# EAGLE board Roland+mem1 (EAGLE 6.6.0)
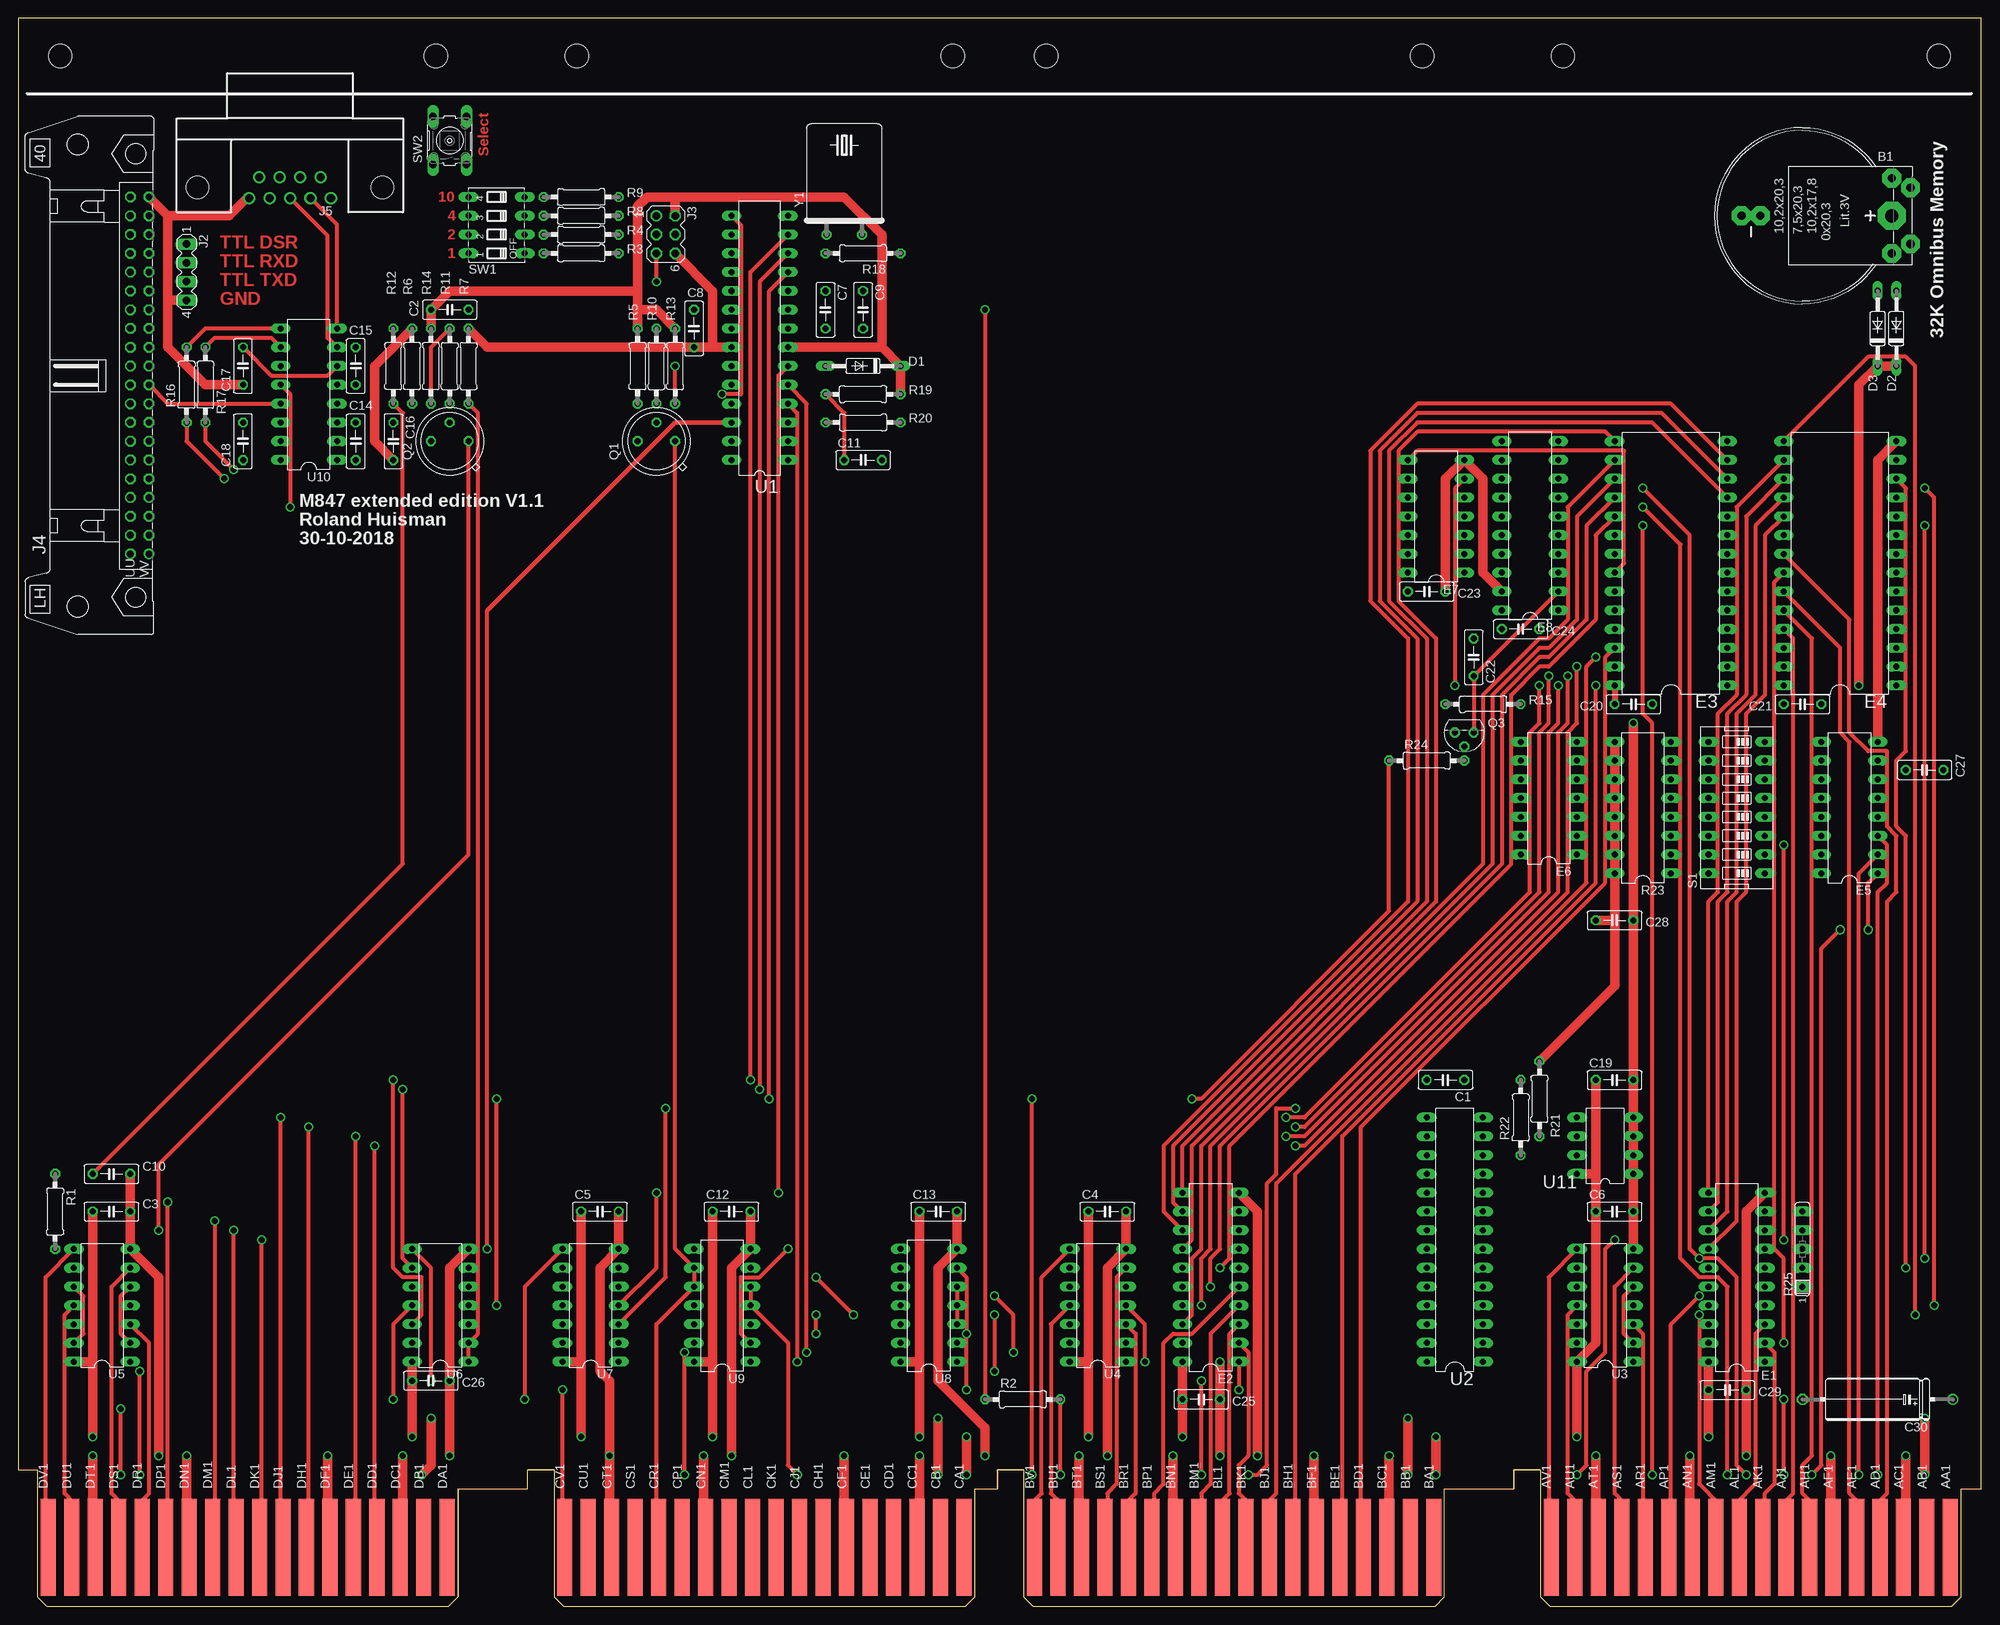
[diagram p3: board, top side]
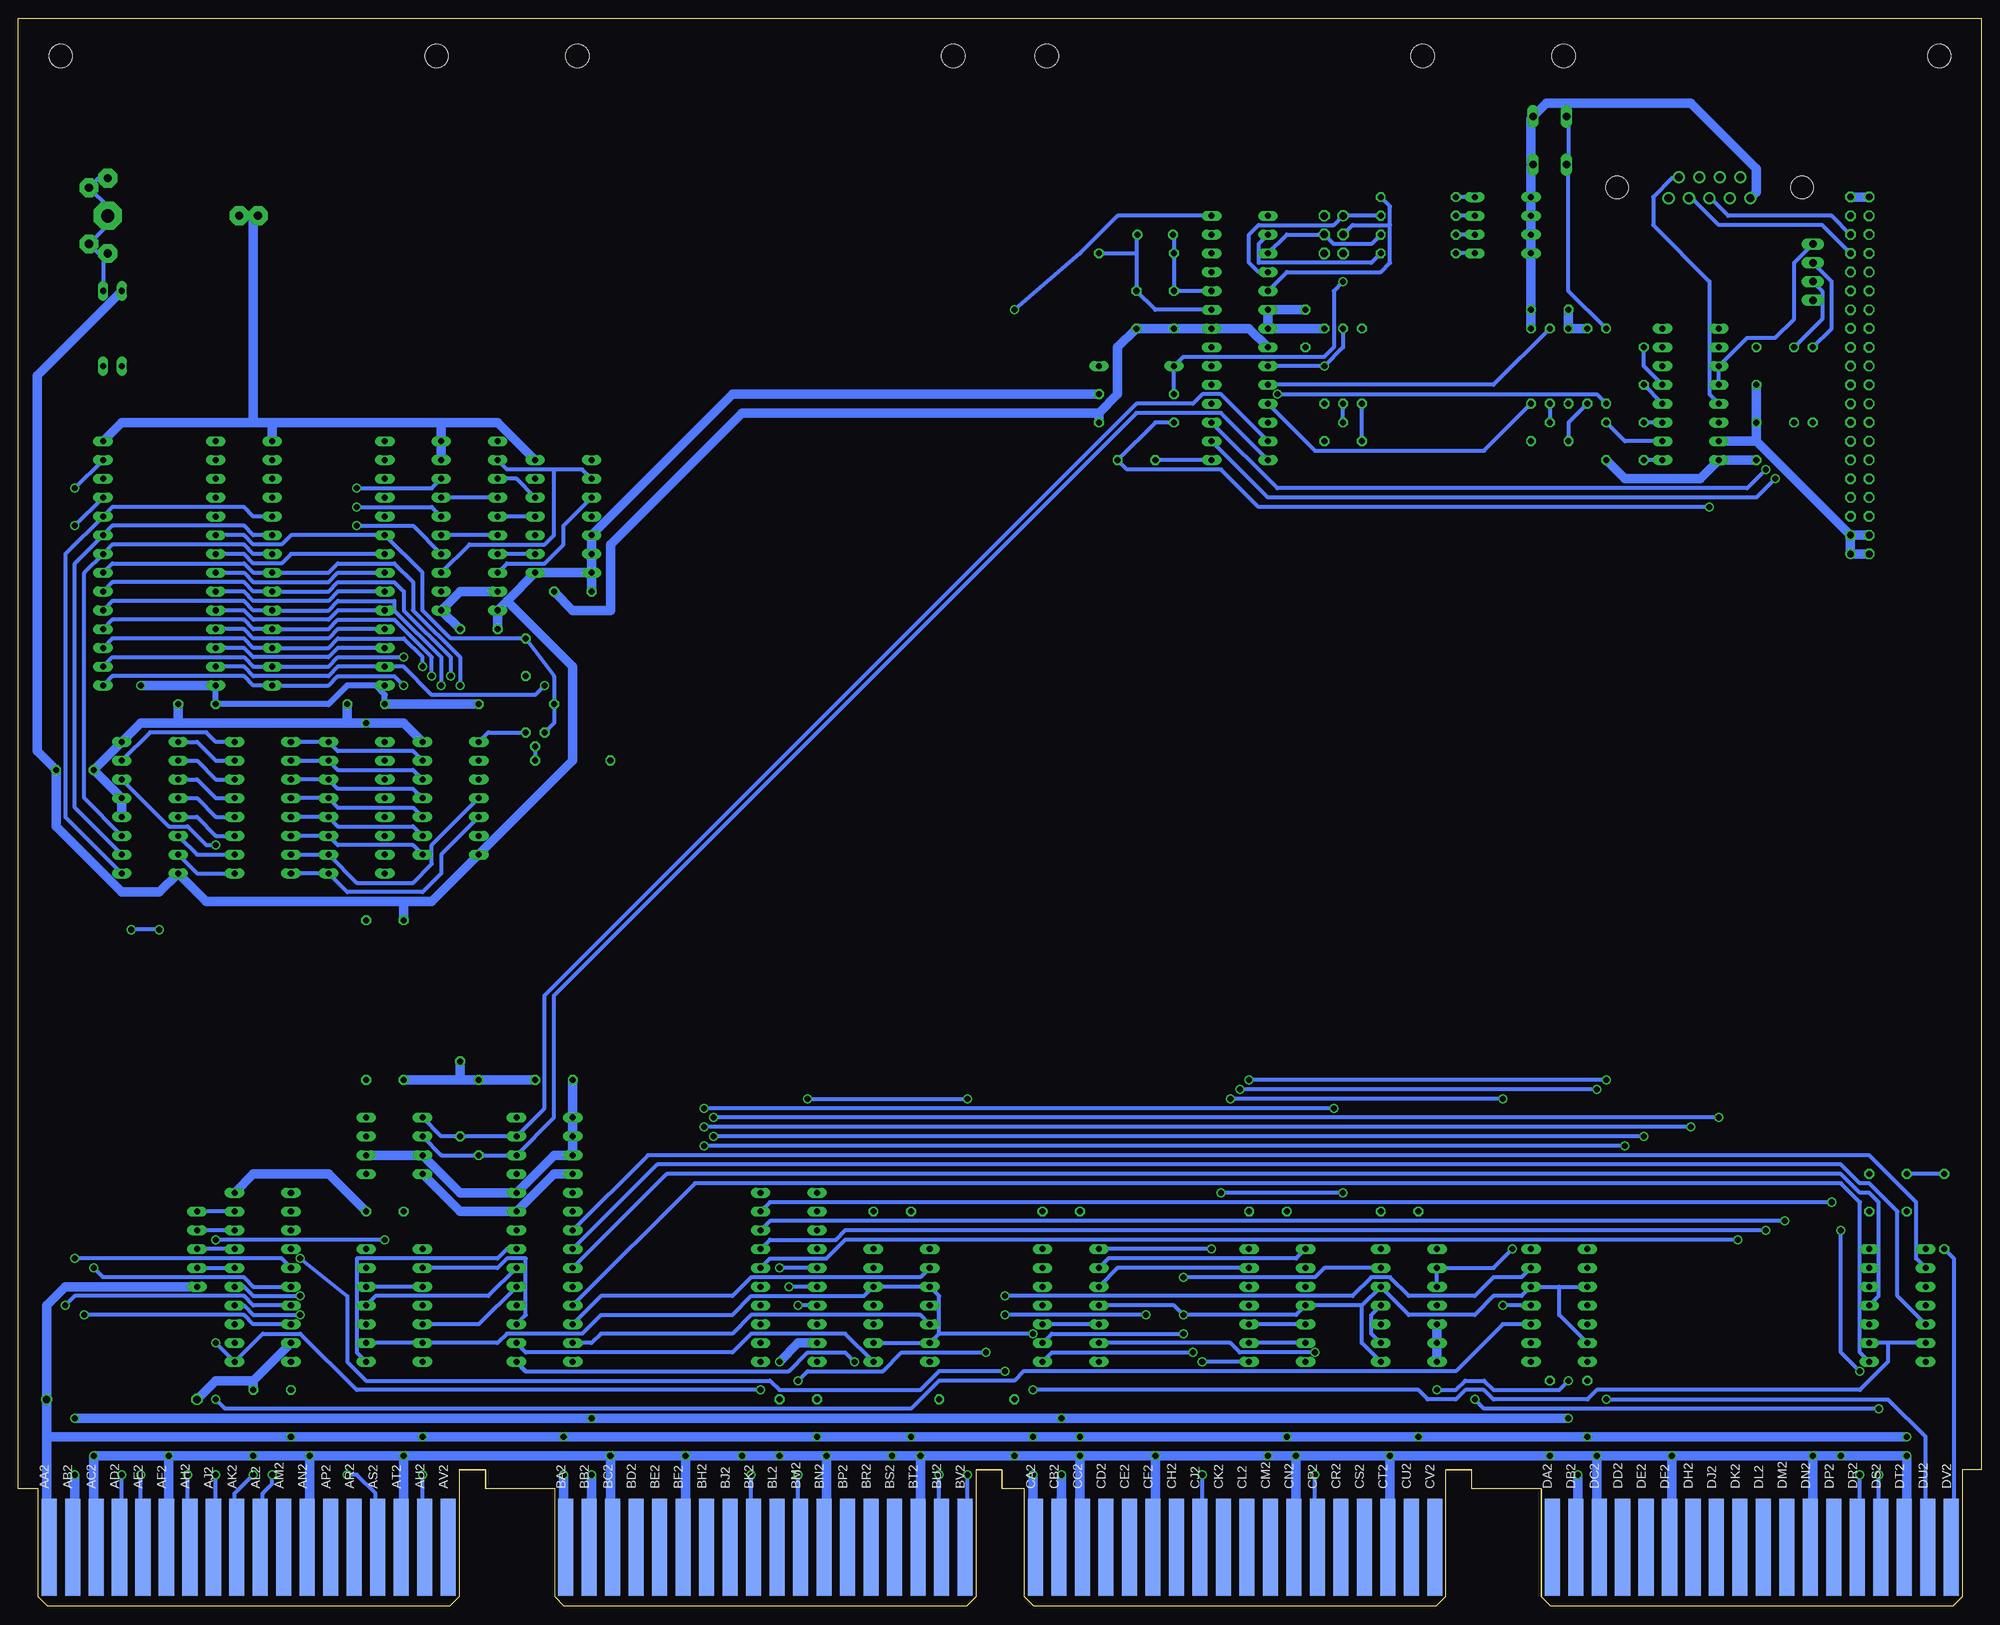
[diagram p4: board, bottom side, seen from below]

Size 265.3 x 214.63 mm. Coordinates in mm from the lower left corner, seen from the top.
Copper layers (1+16): Top 0.035mm / dielectric 1.5mm / Bottom 0.035mm
Design rules "16mils": minimum track width 16mil, minimum drill 32mil, track to track 15mil, track to pad 10mil, pad to pad 10mil, via to via 10mil, smd to smd 10mil, copper to edge 13mil, drill to drill 10mil, minimum pad ring 10mil, minimum via ring 8mil, stop-mask expansion 0mil, vias tented up to drill 0mil, thermal gap 10mil
Net classes: 0 default: width 0.508 mm; 1 supply: width 1.27 mm

## Footprints (pad centres in the part's own frame; a part is rotated, then mirrored left to right if it is on the bottom)
B2430UNI = drill 1.118 pad 2.54 octagon: + 3.81,14.605; +@1 -3.81,14.605; +@2 -5.08,12.065; +@3 5.08,12.065; - 0,-5.715; -@1 0,-8.255 | drill 1.803 pad 3.81 octagon: +@4 0,12.065
C050-025X075 = drill 0.813 octagon: 1 -2.54,0; 2 2.54,0
E12-8 = drill 1.016: + -10.16,0 | drill 1.016 octagon: - 10.16,0
DO35-10 = drill 0.813 long: A 5.08,0; C -5.08,0
DIL20 = drill 0.813 long: 1 -11.43,-3.81; 2 -8.89,-3.81; 3 -6.35,-3.81; 4 -3.81,-3.81; 5 -1.27,-3.81; 6 1.27,-3.81; 7 3.81,-3.81; 8 6.35,-3.81; 9 8.89,-3.81; 10 11.43,-3.81; 11 11.43,3.81; 12 8.89,3.81; 13 6.35,3.81; 14 3.81,3.81; 15 1.27,3.81; 16 -1.27,3.81; 17 -3.81,3.81; 18 -6.35,3.81; 19 -8.89,3.81; 20 -11.43,3.81
DIL28-6 = drill 0.813 long: 1 -16.51,-7.62; 2 -13.97,-7.62; 3 -11.43,-7.62; 4 -8.89,-7.62; 5 -6.35,-7.62; 6 -3.81,-7.62; 7 -1.27,-7.62; 8 1.27,-7.62; 9 3.81,-7.62; 10 6.35,-7.62; 11 8.89,-7.62; 12 11.43,-7.62; 13 13.97,-7.62; 14 16.51,-7.62; 15 16.51,7.62; 16 13.97,7.62; 17 11.43,7.62; 18 8.89,7.62; 19 6.35,7.62; 20 3.81,7.62; 21 1.27,7.62; 22 -1.27,7.62; 23 -3.81,7.62; 24 -6.35,7.62; 25 -8.89,7.62; 26 -11.43,7.62; 27 -13.97,7.62; 28 -16.51,7.62
DIL16 = drill 0.813 long: 1 -8.89,-3.81; 2 -6.35,-3.81; 3 -3.81,-3.81; 4 -1.27,-3.81; 5 1.27,-3.81; 6 3.81,-3.81; 7 6.35,-3.81; 8 8.89,-3.81; 9 8.89,3.81; 10 6.35,3.81; 11 3.81,3.81; 12 1.27,3.81; 13 -1.27,3.81; 14 -3.81,3.81; 15 -6.35,3.81; 16 -8.89,3.81
DIL14 = drill 0.813 long: 1 -7.62,-3.81; 2 -5.08,-3.81; 3 -2.54,-3.81; 4 0,-3.81; 5 2.54,-3.81; 6 5.08,-3.81; 7 7.62,-3.81; 8 7.62,3.81; 9 5.08,3.81; 10 2.54,3.81; 11 0,3.81; 12 -2.54,3.81; 13 -5.08,3.81; 14 -7.62,3.81
EDGE-CON8 = smd 2.032 x 13.106: AA1 261.303,7.938; AB1 258.127,7.938; AC1 254.952,7.938; AD1 251.778,7.938; AE1 248.602,7.938; AF1 245.428,7.938; AH1 242.252,7.938; AJ1 239.077,7.938; AK1 235.903,7.938; AL1 232.727,7.938; AM1 229.553,7.938; AN1 226.377,7.938; AP1 223.202,7.938; AR1 220.028,7.938; AS1 216.852,7.938; AT1 213.678,7.938; AU1 210.502,7.938; AV1 207.327,7.938; BA1 191.452,7.938; BB1 188.278,7.938; BC1 185.102,7.938; BD1 181.928,7.938; BE1 178.752,7.938; BF1 175.577,7.938; BH1 172.403,7.938; BJ1 169.227,7.938; BK1 166.053,7.938; BL1 162.877,7.938; BM1 159.702,7.938; BN1 156.528,7.938; BP1 153.352,7.938; BR1 150.178,7.938; BS1 147.002,7.938; BT1 143.827,7.938; BU1 140.653,7.938; BV1 137.477,7.938; CA1 127.953,7.938; CB1 124.778,7.938; CC1 121.603,7.938; CD1 118.427,7.938; CE1 115.252,7.938; CF1 112.078,7.938; CH1 108.903,7.938; CJ1 105.728,7.938; CK1 102.552,7.938; CL1 99.377,7.938; CM1 96.203,7.938; CN1 93.028,7.938; CP1 89.853,7.938; CR1 86.677,7.938; CS1 83.502,7.938; CT1 80.328,7.938; CU1 77.153,7.938; CV1 73.978,7.938; DA1 58.102,7.938; DB1 54.928,7.938; DC1 51.752,7.938; DD1 48.578,7.938; DE1 45.403,7.938; DF1 42.227,7.938; DH1 39.053,7.938; DJ1 35.877,7.938; DK1 32.703,7.938; DL1 29.527,7.938; DM1 26.352,7.938; DN1 23.177,7.938; DP1 20.003,7.938; DR1 16.828,7.938; DS1 13.652,7.938; DT1 10.477,7.938; DU1 7.303,7.938; DV1 4.128,7.938 | smd 2.032 x 13.106 bottom: AA2 261.303,7.938; AB2 258.127,7.938; AC2 254.952,7.938; AD2 251.778,7.938; AE2 248.602,7.938; AF2 245.428,7.938; AH2 242.252,7.938; AJ2 239.077,7.938; AK2 235.903,7.938; AL2 232.727,7.938; AM2 229.553,7.938; AN2 226.377,7.938; AP2 223.202,7.938; AR2 220.028,7.938; AS2 216.852,7.938; AT2 213.678,7.938; AU2 210.502,7.938; AV2 207.327,7.938; BA2 191.452,7.938; BB2 188.278,7.938; BC2 185.102,7.938; BD2 181.928,7.938; BE2 178.752,7.938; BF2 175.577,7.938; BH2 172.403,7.938; BJ2 169.227,7.938; BK2 166.053,7.938; BL2 162.877,7.938; BM2 159.702,7.938; BN2 156.528,7.938; BP2 153.352,7.938; BR2 150.178,7.938; BS2 147.002,7.938; BT2 143.827,7.938; BU2 140.653,7.938; BV2 137.477,7.938; CA2 127.953,7.938; CB2 124.778,7.938; CC2 121.603,7.938; CD2 118.427,7.938; CE2 115.252,7.938; CF2 112.078,7.938; CH2 108.903,7.938; CJ2 105.728,7.938; CK2 102.552,7.938; CL2 99.377,7.938; CM2 96.203,7.938; CN2 93.028,7.938; CP2 89.853,7.938; CR2 86.677,7.938; CS2 83.502,7.938; CT2 80.328,7.938; CU2 77.153,7.938; CV2 73.978,7.938; DA2 58.102,7.938; DB2 54.928,7.938; DC2 51.752,7.938; DD2 48.578,7.938; DE2 45.403,7.938; DF2 42.227,7.938; DH2 39.053,7.938; DJ2 35.877,7.938; DK2 32.703,7.938; DL2 29.527,7.938; DM2 26.352,7.938; DN2 23.177,7.938; DP2 20.003,7.938; DR2 16.828,7.938; DS2 13.652,7.938; DT2 10.477,7.938; DU2 7.303,7.938; DV2 4.128,7.938
MA04-1 = drill 1.016 long: 1 -3.81,0; 2 -1.27,0; 3 1.27,0; 4 3.81,0
MA03-2 = drill 1.016: 1 -2.54,-1.27 | drill 1.016 octagon: 2 -2.54,1.27; 3 0,-1.27; 4 0,1.27; 5 2.54,-1.27; 6 2.54,1.27
DEC40PINH = drill 0.914 octagon: A 24.13,1.27; AA -3.81,1.27; B 24.13,-1.27; BB -3.81,-1.27; C 21.59,1.27; CC -6.35,1.27; D 21.59,-1.27; DD -6.35,-1.27; E 19.05,1.27; EE -8.89,1.27; F 19.05,-1.27; FF -8.89,-1.27; H 16.51,1.27; HH -11.43,1.27; J 16.51,-1.27; JJ -11.43,-1.27; K 13.97,1.27; KK -13.97,1.27; L 13.97,-1.27; LL -13.97,-1.27; M 11.43,1.27; MM -16.51,1.27; N 11.43,-1.27; NN -16.51,-1.27; P 8.89,1.27; PP -19.05,1.27; R 8.89,-1.27; RR -19.05,-1.27; S 6.35,1.27; SS -21.59,1.27; T 6.35,-1.27; TT -21.59,-1.27; U 3.81,1.27; UU -24.13,1.27; V 3.81,-1.27; W 1.27,1.27; X 1.27,-1.27; Y -1.27,1.27; Z -1.27,-1.27 | drill 0.914: VV -24.13,-1.27
H5M09RA = drill 1.092: 1 -5.537,1.422; 2 -2.769,1.422; 3 0,1.422; 4 2.769,1.422; 5 5.537,1.422; 6 -4.153,-1.422; 7 -1.384,-1.422; 8 1.384,-1.422; 9 4.153,-1.422 | hole 3.048: -12.497,0; 12.497,0
TO5 = drill 0.813 octagon: 1 0,-2.54; 2 2.54,0; 3 0,2.54
TO92 = drill 0.813 octagon: 1 1.27,0; 2 0,1.905; 3 -1.27,0
0207/10 = drill 0.813 octagon: 1 -5.08,0; 2 5.08,0
SIL5 = drill 0.813 long: 1 -5.08,0; 2 -2.54,0; 3 0,0; 4 2.54,0; 5 5.08,0
EDG-08 = drill 0.813 long: 1 -8.89,-3.81; 2 -6.35,-3.81; 3 -3.81,-3.81; 4 -1.27,-3.81; 5 1.27,-3.81; 6 3.81,-3.81; 7 6.35,-3.81; 8 8.89,-3.81; 9 8.89,3.81; 10 6.35,3.81; 11 3.81,3.81; 12 1.27,3.81; 13 -1.27,3.81; 14 -3.81,3.81; 15 -6.35,3.81; 16 -8.89,3.81
DIP04S = drill 0.813 long: 1 -3.81,-3.81; 2 -1.27,-3.81; 3 1.27,-3.81; 4 3.81,-3.81; 5 3.81,3.81; 6 1.27,3.81; 7 -1.27,3.81; 8 -3.81,3.81
B3F-10XX = drill 1.016 long: 1 -3.251,2.261; 2 3.251,2.261; 3 -3.251,-2.261; 4 3.251,-2.261
DIL28-3 = drill 0.813 long: 1 -16.51,-3.81; 2 -13.97,-3.81; 3 -11.43,-3.81; 4 -8.89,-3.81; 5 -6.35,-3.81; 6 -3.81,-3.81; 7 -1.27,-3.81; 8 1.27,-3.81; 9 3.81,-3.81; 10 6.35,-3.81; 11 8.89,-3.81; 12 11.43,-3.81; 13 13.97,-3.81; 14 16.51,-3.81; 15 16.51,3.81; 16 13.97,3.81; 17 11.43,3.81; 18 8.89,3.81; 19 6.35,3.81; 20 3.81,3.81; 21 1.27,3.81; 22 -1.27,3.81; 23 -3.81,3.81; 24 -6.35,3.81; 25 -8.89,3.81; 26 -11.43,3.81; 27 -13.97,3.81; 28 -16.51,3.81
DIL8 = drill 0.813 long: 1 -3.81,-3.81; 2 -1.27,-3.81; 3 1.27,-3.81; 4 3.81,-3.81; 5 3.81,3.81; 6 1.27,3.81; 7 -1.27,3.81; 8 -3.81,3.81
OMNIBUS = hole 3.175: 208.915,209.55; 259.715,209.55; 189.865,209.55; 139.065,209.55; 75.616,209.55; 126.416,209.55; 56.566,209.55; 5.766,209.55
HC49U-H = drill 0.813: 1 -2.413,-5.08; 2 2.413,-5.08

## Placement (x,y rotation side)
B1  CR2032  [B2430UNI]  241.17,187.96 270 top
C1  100nF  [C050-025X075]  192.91,71.12 180 top
C2  100nF  [C050-025X075]  58.29,175.26 0 top
C3  100nF  [C050-025X075]  12.57,53.34 0 top
C4  100nF  [C050-025X075]  147.19,53.34 0 top
C5  100nF  [C050-025X075]  78.61,53.34 0 top
C6  100nF  [C050-025X075]  215.77,53.34 0 top
C7  22pF  [C050-025X075]  109.09,175.26 270 top
C8  100nF  [C050-025X075]  91.31,172.72 270 top
C9  22pF  [C050-025X075]  114.17,175.26 270 top
C10  100nF  [C050-025X075]  12.57,58.42 0 top
C11  100nF  [C050-025X075]  114.17,154.94 0 top
C12  100nF  [C050-025X075]  96.39,53.34 0 top
C13  100nF  [C050-025X075]  124.33,53.34 0 top
C14  100nF  [C050-025X075]  45.59,157.48 90 top
C15  100nF  [C050-025X075]  45.59,167.64 90 top
C16  100nF  [C050-025X075]  50.67,157.48 270 top
C17  100nF  [C050-025X075]  30.35,167.64 90 top
C18  100nF  [C050-025X075]  30.35,157.48 90 top
C19  100nF  [C050-025X075]  215.77,71.12 0 top
C20  0.1uF  [C050-025X075]  218.31,121.92 0 top
C21  0.1uF  [C050-025X075]  241.17,121.92 0 top
C22  200pF  [C050-025X075]  196.72,128.27 270 top
C23  100nF  [C050-025X075]  190.37,137.16 0 top
C24  100nF  [C050-025X075]  203.07,132.08 0 top
C25  100nF  [C050-025X075]  159.89,27.94 0 top
C26  100nF  [C050-025X075]  55.75,30.48 0 top
C27  100nF  [C050-025X075]  257.68,113.03 180 top
C28  100nF  [C050-025X075]  215.77,92.71 0 top
C29  100nF  [C050-025X075]  231.01,29.21 0 top
C30  100uF  [E12-8]  251.33,27.94 180 top
D1  1N4148  [DO35-10]  114.17,167.64 180 top
D2  BAT86  [DO35-10]  253.87,172.72 90 top
D3  BAT86  [DO35-10]  251.33,172.72 90 top
E1  74ALS245AN  [DIL20]  232.28,44.45 90 top
E2  74ALS245AN  [DIL20]  161.16,44.45 90 top
E3  62256  [DIL28-6]  223.39,140.97 90 top
E4  62256  [DIL28-6]  246.25,140.97 90 top
E5  74ACT138N  [DIL16]  247.52,107.95 90 top
E6  74HCT30N  [DIL14]  206.88,109.22 90 top
E7  74ACT20N  [DIL14]  191.64,147.32 90 top
E8  74LS540N  [DIL20]  204.34,146.05 90 top
J1  EDGE  [EDGE-CON8]  -0.13,0 0 top
J2  COMM  [MA04-1]  22.73,180.34 270 top
J3  ICSP  [MA03-2]  87.5,185.42 270 top
J4  Serial  [DEC40PINH]  16.38,166.37 90 top
J5  D-SUB9-HM  [H5M09RA]  36.7,191.77 180 top
Q1  BC547  [TO5]  86.23,157.48 90 top
Q2  BC547  [TO5]  58.29,157.48 90 top
Q3  2N3904  [TO92]  195.45,118.11 180 top
R1  1K  [0207/10]  4.95,53.34 270 top
R2  1K  [0207/10]  135.76,27.94 0 top
R3  1K  [0207/10]  76.07,182.88 180 top
R4  1K  [0207/10]  76.07,185.42 180 top
R5  27  [0207/10]  83.69,167.64 90 top
R6  27  [0207/10]  53.21,167.64 90 top
R7  4.7K  [0207/10]  60.83,167.64 270 top
R8  1K  [0207/10]  76.07,187.96 180 top
R9  1K  [0207/10]  76.07,190.5 180 top
R10  27  [0207/10]  86.23,167.64 270 top
R11  27  [0207/10]  58.29,167.64 270 top
R12  47  [0207/10]  50.67,167.64 90 top
R13  470  [0207/10]  88.77,167.64 90 top
R14  470  [0207/10]  55.75,167.64 90 top
R15  100K  [0207/10]  197.99,121.92 0 top
R16  1K  [0207/10]  22.73,165.1 90 top
R17  1K  [0207/10]  25.27,165.1 90 top
R18  1M  [0207/10]  114.17,182.88 180 top
R19  10K  [0207/10]  114.17,163.83 0 top
R20  1K  [0207/10]  114.17,160.02 180 top
R21  4.7K  [0207/10]  205.61,68.58 90 top
R22  4.7K  [0207/10]  203.07,66.04 90 top
R23  10K  [DIL16]  219.58,107.95 90 top
R24  100K  [0207/10]  190.37,114.3 0 top
R25  10K  [SIL5]  241.17,48.26 90 top
S1  01234567  [EDG-08]  232.28,107.95 90 top
SW1  DIP-4  [DIP04S]  64.64,186.69 90 top
SW2  10-XX  [B3F-10XX]  58.29,198.12 90 top
U1  MEGA328-P  [DIL28-3]  100.2,171.45 90 top
U2  MCP23017SP  [DIL28-3]  194.18,49.53 90 top
U3  74LS38N  [DIL14]  214.5,40.64 90 top
U4  74LS38N  [DIL14]  145.92,40.64 90 top
U5  74LS38N  [DIL14]  11.3,40.64 90 top
U6  74LS38N  [DIL14]  57.02,40.64 90 top
U7  74LS38N  [DIL14]  77.34,40.64 90 top
U8  74LS10N  [DIL14]  123.06,40.64 90 top
U9  74LS00N  [DIL14]  95.12,40.64 90 top
U10  MAX232  [DIL16]  39.24,163.83 90 top
U11  24LC1025P  [DIL8]  214.5,62.23 90 top
U$1  OUTLINE-OMNIBUS  [OMNIBUS]  -0.13,0 0 top
Y1  16.000MHz  [HC49U-H]  111.63,190.5 0 top

## Tracks (layer width: path | path; a pad name or v marks a point on that pad's centre or on a via)
!BMD_DIR
  Bottom 0.508: E7.2 E8.17
!BRK_DATA  (via drill 0.81, 0.81 pad 0.25)
  Top 0.508: U7.3 87.5,44.45 v87.5,67.31 | v166.24,17.78 167.51,17.78 168.78,19.05 168.78,57.15 170.05,58.42 170.05,67.31 v172.59,67.31
  Bottom 0.508: J1.BK2 166.24,8.26 v166.24,17.78 | v87.5,67.31 v172.59,67.31
!CE
  Bottom 0.508: E4.20 234.82,144.78 233.55,143.51 229.74,143.51 228.47,144.78 E3.20 210.69,139.7 210.69,134.62 206.88,130.81 C22.1 192.91,125.73 R15.1 192.91,119.38 Q3.1
!DATA00
  Top 0.508: J1.AR1 219.58,8.26 219.58,36.83 U3.3
!DATA01
  Top 0.508: J1.AS1 217.04,8.26 217.04,13.97 215.77,15.24 215.77,43.18 U3.6
!DATA02
  Top 0.508: J1.AU1 210.69,8.26 210.69,13.97 209.42,15.24 209.42,39.37 U3.11
!DATA03
  Top 0.508: J1.AV1 206.88,8.26 206.88,44.45 U3.8
!DATA04
  Top 0.508: J1.BR1 149.73,8.26 149.73,13.97 151,15.24 151,36.83 U4.3
!DATA05
  Top 0.508: J1.BS1 147.19,8.26 147.19,15.24 148.46,16.51 148.46,44.45 U4.6
!DATA06
  Top 0.508: J1.BU1 140.84,8.26 140.84,13.97 139.57,15.24 139.57,38.1 U4.11
!DATA07
  Top 0.508: J1.BV1 137.03,8.26 137.03,13.97 138.3,15.24 138.3,44.45 U4.8
!DATA08
  Top 0.508: J1.DR1 16.38,8.26 16.38,13.97 17.65,15.24 17.65,35.56 U5.3
!DATA09
  Top 0.508: J1.DS1 13.84,8.26 13.84,13.97 12.57,15.24 12.57,43.18 U5.6
!DATA10
  Top 0.508: J1.DU1 7.49,8.26 7.49,13.97 6.22,15.24 6.22,39.37 U5.11
!DATA11
  Top 0.508: J1.DV1 3.68,8.26 3.68,44.45 U5.8
!DISABLE
  Bottom 0.508: E8.18 199.26,140.97 194.18,140.97 191.64,143.51 191.64,146.05 E7.10
!EMA0  (via drill 0.81)
  Top 0.508: v251.33,17.78 251.33,96.52 252.6,97.79 252.6,102.87 E5.3
  Bottom 0.508: E3.8 233.55,142.24 234.82,143.51 252.6,143.51 E4.8 256.41,139.7 256.41,109.22 E5.3 | J1.AD2 251.33,8.26 v251.33,17.78
!EMA1  (via drill 0.81)
  Top 0.508: v248.79,17.78 248.79,99.06 E5.2
  Bottom 0.508: E3.9 233.55,144.78 234.82,146.05 252.6,146.05 E4.9 257.68,140.97 257.68,107.95 E5.2 | J1.AE2 248.79,8.26 v248.79,17.78
!EMA2  (via drill 0.81)
  Top 0.508: v242.44,17.78 243.71,19.05 243.71,88.9 v246.25,91.44 | v250.06,91.44 250.06,97.79 E5.1
  Bottom 0.508: E3.10 233.55,147.32 234.82,148.59 252.6,148.59 E4.10 258.95,142.24 258.95,106.68 E5.1 | J1.AH2 242.44,8.26 v242.44,17.78 | v246.25,91.44 v250.06,91.44
!KEY_CONT  (via drill 0.81)
  Top 0.508: U6.11 50.67,38.1 v50.67,27.94
  Bottom 0.508: J1.DU2 7.49,8.26 7.49,22.86 12.57,27.94 v50.67,27.94
!LA_ENABLE  (via drill 0.81, 0.81 pad 0.25)
  Top 0.508: v159.89,17.78 v159.89,30.48 | v134.49,34.29 134.49,39.37 v131.95,41.91
  Bottom 0.508: J1.BM2 159.89,8.26 v159.89,17.78 | U6.6 62.1,44.45 65.91,44.45 68.45,41.91 77.34,41.91 79.88,44.45 82.42,44.45 84.96,41.91 v131.95,41.91 | v159.89,30.48 158.62,31.75 148.46,31.75 145.92,34.29 v134.49,34.29
!MA00
  Top 0.508: J1.AD1 251.33,8.26 251.33,13.97 252.6,15.24 252.6,95.25 253.87,96.52 253.87,104.14 252.6,105.41 252.6,115.57 250.06,115.57 247.52,118.11 247.52,133.35 E4.21
  Bottom 0.508: E3.21 228.47,142.24 229.74,140.97 233.55,140.97 234.82,142.24 E4.21
!MA01
  Top 0.508: J1.AE1 248.79,8.26 248.79,13.97 247.52,15.24 247.52,116.84 246.25,118.11 246.25,129.54 E4.23
  Bottom 0.508: E3.23 222.12,137.16 223.39,135.89 233.55,135.89 234.82,137.16 E4.23
!MA02
  Top 0.508: J1.AH1 242.44,8.26 242.44,13.97 241.17,15.24 241.17,19.05 242.44,20.32 242.44,130.81 E4.24
  Bottom 0.508: E3.24 222.12,134.62 223.39,133.35 233.55,133.35 234.82,134.62 E4.24
!MA03
  Top 0.508: J1.AJ1 238.63,8.26 238.63,13.97 239.9,15.24 239.9,130.81 E4.25
  Bottom 0.508: E3.25 222.12,132.08 223.39,130.81 233.55,130.81 234.82,132.08 E4.25
!MA04
  Top 0.508: J1.BD1 181.48,8.26 181.48,64.77 214.5,97.79 214.5,128.27 E3.26
  Bottom 0.508: E3.26 222.12,129.54 223.39,128.27 233.55,128.27 234.82,129.54 E4.26
!MA05  (via drill 0.81)
  Top 0.508: J1.BE1 178.94,8.26 178.94,63.5 213.23,97.79 v213.23,124.46
  Bottom 0.508: E4.1 252.6,125.73 234.82,125.73 233.55,124.46 E3.1 223.39,124.46 222.12,125.73 214.5,125.73 v213.23,124.46
!MA06  (via drill 0.81)
  Top 0.508: J1.BH1 172.59,8.26 172.59,58.42 211.96,97.79 211.96,127 v213.23,128.27
  Bottom 0.508: E4.2 252.6,128.27 234.82,128.27 233.55,127 E3.2 223.39,127 222.12,128.27 v213.23,128.27
!MA07  (via drill 0.81)
  Top 0.508: J1.BJ1 168.78,8.26 168.78,13.97 170.05,15.24 170.05,57.15 209.42,96.52 209.42,118.11 210.69,119.38 v210.69,127
  Bottom 0.508: E4.3 252.6,130.81 234.82,130.81 233.55,129.54 E3.3 223.39,129.54 222.12,130.81 213.23,130.81 210.69,128.27 v210.69,127
!MA08  (via drill 0.81, 0.81 pad 0.25)
  Top 0.508: J1.DD1 48.13,8.26 v48.13,62.23 | v209.42,125.73 209.42,119.38 208.15,118.11 208.15,96.52 173.86,62.23 v172.59,62.23
  Bottom 0.508: E4.4 252.6,133.35 234.82,133.35 233.55,132.08 E3.4 223.39,132.08 222.12,133.35 214.5,133.35 209.42,128.27 v209.42,125.73 | v48.13,62.23 v172.59,62.23
!MA09  (via drill 0.81)
  Top 0.508: J1.DE1 45.59,8.26 v45.59,63.5 | v208.15,124.46 208.15,119.38 206.88,118.11 206.88,96.52 173.86,63.5 v171.32,63.5
  Bottom 0.508: E4.5 252.6,135.89 234.82,135.89 233.55,134.62 E3.5 223.39,134.62 222.12,135.89 214.5,135.89 214.5,134.62 208.15,128.27 v208.15,124.46 | v45.59,63.5 v171.32,63.5
!MA10  (via drill 0.81)
  Top 0.508: J1.DH1 39.24,8.26 v39.24,64.77 | v206.88,125.73 206.88,119.38 205.61,118.11 205.61,96.52 173.86,64.77 v172.59,64.77
  Bottom 0.508: E4.6 252.6,138.43 234.82,138.43 233.55,137.16 E3.6 223.39,137.16 222.12,138.43 214.5,138.43 213.23,137.16 213.23,134.62 206.88,128.27 v206.88,125.73 | v39.24,64.77 v172.59,64.77
!MA11  (via drill 0.81)
  Top 0.508: J1.DJ1 35.43,8.26 v35.43,66.04 | v205.61,124.46 205.61,119.38 204.34,118.11 204.34,96.52 173.86,66.04 v171.32,66.04
  Bottom 0.508: E4.7 252.6,140.97 234.82,140.97 233.55,139.7 E3.7 223.39,139.7 222.12,140.97 214.5,140.97 211.96,138.43 211.96,134.62 205.61,128.27 v205.61,124.46 | v35.43,66.04 v171.32,66.04
!MD00
  Top 0.508: J1.AK1 236.09,8.26 236.09,15.24 237.36,16.51 237.36,34.29 E1.2
!MD01
  Top 0.508: J1.AL1 232.28,8.26 232.28,13.97 234.82,16.51 234.82,36.83 E1.3
!MD02  (via drill 0.81 pad 0.25)
  Top 0.508: J1.AM1 229.74,8.26 229.74,13.97 227.2,16.51 v227.2,39.37
  Bottom 0.508: E1.4 234.82,40.64 233.55,39.37 v227.2,39.37
!MD03  (via drill 0.81 pad 0.25)
  Top 0.508: J1.AP1 223.39,8.26 223.39,38.1 v227.2,41.91
  Bottom 0.508: E1.5 234.82,43.18 233.55,41.91 v227.2,41.91
!MD04
  Top 0.508: J1.BK1 166.24,8.26 166.24,13.97 164.97,15.24 164.97,19.05 166.24,20.32 166.24,34.29 E2.2
!MD05
  Top 0.508: J1.BL1 162.43,8.26 162.43,13.97 163.7,15.24 163.7,36.83 E2.3
!MD06
  Top 0.508: J1.BM1 159.89,8.26 159.89,15.24 161.16,16.51 161.16,36.83 E2.4
!MD07
  Top 0.508: J1.BP1 153.54,8.26 153.54,15.24 154.81,16.51 154.81,35.56 156.08,36.83 158.62,36.83 E2.5
!MD08  (via drill 0.81 pad 0.25)
  Top 0.508: J1.DK1 32.89,8.26 v32.89,49.53
  Bottom 0.508: v32.89,49.53 153.54,49.53 156.08,46.99 163.7,46.99 E2.6
!MD09  (via drill 0.81 pad 0.25)
  Top 0.508: J1.DL1 29.08,8.26 v29.08,50.8
  Bottom 0.508: v29.08,50.8 153.54,50.8 154.81,49.53 163.7,49.53 E2.7
!MD10  (via drill 0.81 pad 0.25)
  Top 0.508: J1.DM1 26.54,8.26 v26.54,52.07
  Bottom 0.508: v26.54,52.07 163.7,52.07 E2.8
!MD11  (via drill 0.81 pad 0.25)
  Top 0.508: J1.DP1 20.19,8.26 v20.19,54.61
  Bottom 0.508: v20.19,54.61 163.7,54.61 E2.9
!MD_DIR  (via drill 0.81, 0.81 pad 0.25)
  Top 0.508: v233.55,17.78 232.28,19.05 232.28,44.45 229.74,46.99 v227.2,46.99 225.93,48.26 225.93,144.78 v219.58,151.13 | v107.82,44.45 v112.9,39.37 | v131.95,39.37 v131.95,31.75
  Bottom 0.508: J1.AK2 236.09,8.26 236.09,15.24 v233.55,17.78 | v219.58,151.13 209.42,151.13 E8.8 | v227.2,46.99 220.85,41.91 220.85,33.02 218.31,30.48 163.7,30.48 162.43,29.21 143.38,29.21 140.84,31.75 v131.95,31.75 | U7.6 88.77,45.72 90.04,44.45 v107.82,44.45 | v112.9,39.37 v131.95,39.37
!MEM_START  (via drill 0.81)
  Top 0.508: v238.63,17.78 v238.63,27.94
  Bottom 0.508: J1.AJ2 238.63,8.26 v238.63,17.78 | U6.3 64.64,38.1 70.99,31.75 129.41,31.75 130.68,30.48 140.84,30.48 144.65,26.67 237.36,26.67 v238.63,27.94
!MS_DISABLE  (via drill 0.81)
  Top 0.508: J1.CV1 73.53,8.26 v73.53,29.21 | v55.75,30.48 55.75,45.72 U6.8
  Bottom 0.508: v73.53,29.21 70.99,29.21 69.72,30.48 67.18,30.48 65.91,29.21 57.02,29.21 v55.75,30.48
!READ_EN  (via drill 0.81 pad 0.25)
  Top 0.508: E7.8 189.1,156.21 217.04,156.21 217.04,140.97 E3.22 | E2.1 v164.97,29.21 | v238.63,35.56 238.63,46.99 237.36,48.26 237.36,138.43 E4.22
  Bottom 0.508: E4.22 234.82,139.7 233.55,138.43 223.39,138.43 222.12,139.7 E3.22 | v164.97,29.21 219.58,29.21 227.2,36.83 232.28,36.83 E1.1 v238.63,35.56
!RESET  (via drill 0.81 pad 0.25)
  Top 0.508: R19.1 111.63,161.29 C11.1 | v86.23,179.07 J3.5
  Bottom 0.508: R19.1 D1.A 107.82,168.91 88.77,168.91 87.5,170.18 87.5,177.8 v86.23,179.07 | U1.1 C11.1
!ROM_ADDR  (via drill 0.81, 0.81 pad 0.25)
  Top 0.508: v210.69,17.78 211.96,19.05 211.96,31.75 214.5,34.29 214.5,48.26 v215.77,49.53 | v238.63,49.53 v238.63,102.87
  Bottom 0.508: J1.AU2 210.69,8.26 v210.69,17.78 | E5.6 244.98,105.41 242.44,105.41 239.9,102.87 v238.63,102.87 | v215.77,49.53 v238.63,49.53
!RUN  (via drill 0.81)
  Top 0.508: v140.84,17.78 R2.2
  Bottom 0.508: J1.BU2 140.84,8.26 v140.84,17.78
!SOURCE
  Bottom 0.508: E8.14 E8.7
!STOP  (via drill 0.81)
  Top 0.508: v13.84,17.78 v13.84,26.67 | U7.8 68.45,43.18 v68.45,27.94
  Bottom 0.508: J1.DS2 13.84,8.26 v13.84,17.78 | v13.84,26.67 67.18,26.67 v68.45,27.94
!TP4
  Bottom 0.508: U9.6 116.71,45.72 U8.10
!TS4  (via drill 0.81)
  Top 0.508: v90.04,17.78 v90.04,34.29
  Bottom 0.508: J1.CP2 90.04,8.26 v90.04,17.78 | v90.04,34.29 100.2,34.29 101.47,35.56 U8.13
!W_KEY_CONTROL  (via drill 0.81)
  Top 0.508: U6.12 54.48,39.37 54.48,44.45 51.94,44.45 50.67,45.72 v50.67,71.12 | U1.13 98.93,180.34 v98.93,71.12
  Bottom 0.508: v50.67,71.12 v98.93,71.12
!W_LA_ENABLE  (via drill 0.81, 0.81 pad 0.25)
  Top 0.508: v64.64,40.64 v64.64,68.58 | U1.11 101.47,177.8 v101.47,68.58
  Bottom 0.508: U6.4 v64.64,40.64 | v64.64,68.58 v101.47,68.58
!W_MEM_START
  Top 0.508: U6.1 U6.2 62.1,36.83 62.1,161.29 R7.2
  Bottom 0.508: U1.25 90.04,156.21 67.18,156.21 R7.2
!W_MS_IR_DISABLE  (via drill 0.81)
  Top 0.508: U6.9 51.94,46.99 v51.94,69.85 | U1.12 100.2,179.07 v100.2,69.85
  Bottom 0.508: v51.94,69.85 v100.2,69.85
!WRITE
  Bottom 0.508: E8.16 E8.5
!WRITE_EN  (via drill 0.81)
  Top 0.508: E7.6 194.18,151.13 v194.18,124.46
  Bottom 0.508: E4.27 234.82,127 233.55,125.73 223.39,125.73 222.12,127 E3.27 213.23,127 209.42,123.19 195.45,123.19 v194.18,124.46
-15V  (via drill 0.81)
  Top 1.27: v54.48,17.78 55.75,19.05 v55.75,25.4 | v187.83,17.78 v187.83,25.4 | v257.68,25.4 v257.68,17.78 | v124.33,17.78 v124.33,25.4
  Bottom 1.27: J1.DB2 54.48,7.94 v54.48,17.78 | v55.75,25.4 v124.33,25.4 v187.83,25.4 v257.68,25.4 | J1.BB2 187.83,7.94 v187.83,17.78 | v257.68,17.78 257.68,7.94 J1.AB2 | J1.CB2 124.33,7.94 v124.33,17.78
BSOURCE
  Bottom 0.508: E7.5 197.99,152.4 E8.13
BWRITE
  Bottom 0.508: E7.4 E8.15
DIP_1
  Bottom 0.508: R3.1 82.42,181.61 97.66,181.61 97.66,184.15 U1.16
DIP_2
  Bottom 0.508: R4.1 82.42,184.15 87.5,184.15 J3.4 93.85,185.42 U1.17
DIP_3
  Bottom 0.508: R8.1 J3.1 87.5,186.69 97.66,186.69 98.93,185.42 98.93,181.61 97.66,180.34 U1.18
DIP_4
  Bottom 0.508: U1.19 93.85,180.34 81.15,180.34 79.88,181.61 79.88,186.69 | 79.88,186.69 79.88,189.23 R9.1 | J3.3 84.96,186.69 79.88,186.69
DISABLE
  Top 0.508: Q3.3 C22.2 E8.2
  Bottom 0.508: E6.8 201.8,118.11 Q3.3
DSR232
  Top 0.508: J4.Z 20.19,162.56 U10.13
  Bottom 0.508: J5.6 41.01,193.04 41.78,193.04 44.32,190.5 44.32,186.69 36.7,179.07 36.7,163.83 U10.13
EMEM0
  Top 0.508: E1.14 232.28,52.07 232.28,95.25 233.55,96.52 233.55,120.65 236.09,123.19 236.09,144.78 E4.19
EMEM1
  Top 0.508: E1.13 231.01,53.34 231.01,95.25 232.28,96.52 232.28,120.65 234.82,123.19 234.82,146.05 E4.18
EMEM2
  Top 0.508: E1.12 229.74,54.61 229.74,95.25 231.01,96.52 231.01,120.65 233.55,123.19 233.55,147.32 E4.17
EMEM3
  Top 0.508: E1.11 228.47,95.25 229.74,96.52 229.74,120.65 232.28,123.19 232.28,148.59 E4.16
ENA_DATA  (via drill 0.81)
  Top 0.508: U3.2 217.04,36.83 217.04,41.91 U3.5 | U5.13 8.76,36.83 8.76,41.91 U5.10 | U5.2 13.84,36.83 13.84,41.91 U5.5 | v128.14,29.21 v128.14,36.83 128.14,44.45 U8.6
  Bottom 0.508: U3.2 U3.13 200.53,35.56 199.26,36.83 189.1,36.83 186.56,39.37 168.78,39.37 166.24,41.91 151,41.91 U4.5 U4.10 140.84,41.91 140.84,36.83 | U4.2 U4.13 140.84,36.83 | U3.10 U3.5 | U5.13 12.57,35.56 | 12.57,35.56 U5.2 | 12.57,35.56 12.57,33.02 16.38,29.21 51.94,29.21 53.21,27.94 65.91,27.94 67.18,29.21 69.72,29.21 70.99,27.94 74.8,27.94 76.07,29.21 v128.14,29.21 | v128.14,36.83 140.84,36.83
EXAM  (via drill 0.81 pad 0.25)
  Top 0.508: U7.4 86.23,45.72 v86.23,55.88 | v102.74,55.88 102.74,166.37 U1.6
  Bottom 0.508: U7.2 82.42,36.83 82.42,39.37 U7.4 | v86.23,55.88 v102.74,55.88
FLIP_FLOP  (via drill 0.81 pad 0.25)
  Top 0.508: v107.82,36.83 v107.82,39.37
  Bottom 0.508: U6.13 57.02,39.37 57.02,43.18 | 57.02,43.18 U6.10 | 57.02,43.18 U6.5 62.1,41.91 65.91,41.91 68.45,39.37 77.34,39.37 U7.5 83.69,40.64 | 83.69,40.64 U9.11 92.58,39.37 v107.82,39.37 109.09,40.64 U8.11 | U7.1 83.69,35.56 83.69,40.64 | U8.2 125.6,36.83 v107.82,36.83
GND  (via drill 0.81, 0.81 pad 0.25)
  Top 1.27: E8.19 197.99,139.7 197.99,152.4 E7.7 192.91,152.4 C23.2 | J1.DT2 10.03,7.94 v10.03,20.32 | v22.73,20.32 22.73,8.89 23.05,8.89 J1.DN1 | J1.DF2 41.78,7.94 v41.78,20.32 | J1.DC2 51.94,7.94 v51.94,20.32 | J1.CT1 79.88,7.94 v79.88,20.32 79.88,30.48 78.61,31.75 78.61,45.72 U7.7 C5.2 | J1.CN2 92.58,7.94 v92.58,20.32 | J1.AC1 255.14,7.94 v255.14,20.32 | J1.BC1 185.29,7.94 v185.29,20.32 | J1.AF1 244.98,7.94 v244.98,20.32 | J1.AN2 225.93,7.94 v225.93,20.32 | J1.AT2 213.23,7.94 v213.23,20.32 | J1.BF1 175.13,7.94 v175.13,20.32 | J1.BN1 156.08,7.94 v156.08,20.32 | J1.BT1 143.38,7.94 v143.38,20.32 | J1.CF2 111.63,7.94 v111.63,20.32 | J1.CC2 121.79,7.94 v121.79,20.32 | v233.55,20.32 C29.2 233.55,53.34 E1.10 | v162.43,33.02 C25.2 v162.43,20.32 | C4.2 U4.7 147.19,45.72 v147.19,20.32 | v218.31,119.38 C28.2 C19.2 U11.4 U11.3 U11.2 U11.1 C6.2 U3.7 | C17.1 25.27,165.1 20.19,170.18 20.19,176.53 | 20.19,187.96 J4.B | J2.4 20.19,176.53 | 20.19,176.53 20.19,187.96 | 20.19,187.96 28.47,187.96 31.01,190.5 J5.5 | U1.22 93.85,170.18 | 93.85,170.18 93.85,177.8 J3.6 | 93.85,170.18 C8.2 63.37,170.18 R7.1 | C12.2 U9.7 96.39,45.72 v96.39,20.32 | C13.2 U8.7 124.33,45.72 124.33,30.48 130.68,24.13 v130.68,20.32 | U6.7 58.29,45.72 C26.2 v58.29,20.32 | C10.2 C3.2 U5.7 18.92,44.45 v18.92,20.32 | E5.8 251.33,154.94 E4.14 | E2.10 167.51,53.34 v167.51,20.32
  Bottom 1.27: E3.14 231.01,160.02 | E5.4 E5.5 C27.2 E5.8 248.79,119.38 243.71,119.38 | E6.7 213.23,119.38 v218.31,119.38 220.85,119.38 | 220.85,119.38 243.71,119.38 | E7.7 200.53,160.02 208.15,160.02 | E8.9 E8.10 208.15,160.02 | E8.19 205.61,137.16 E8.1 C24.2 | 208.15,160.02 231.01,160.02 | C1.2 U2.15 U2.16 U2.17 192.91,60.96 U2.10 205.61,55.88 U11.7 U11.2 | B1.-@1 233.55,187.96 | B1.- 233.55,187.96 | v22.73,20.32 v18.92,20.32 v10.03,20.32 10.03,7.94 J1.DT2 | v41.78,20.32 v22.73,20.32 | v51.94,20.32 v41.78,20.32 | J1.CT1 79.88,7.94 v79.88,20.32 | v79.88,20.32 v58.29,20.32 v51.94,20.32 | v92.58,20.32 v79.88,20.32 | v244.98,20.32 v255.14,20.32 255.14,7.94 J1.AC1 | v244.98,20.32 v233.55,20.32 v225.93,20.32 | v225.93,20.32 v213.23,20.32 | v213.23,20.32 v185.29,20.32 | v185.29,20.32 v175.13,20.32 | v175.13,20.32 v167.51,20.32 v162.43,20.32 v156.08,20.32 | v156.08,20.32 v147.19,20.32 v143.38,20.32 | v143.38,20.32 v130.68,20.32 v121.79,20.32 | v121.79,20.32 v111.63,20.32 | v111.63,20.32 v96.39,20.32 v92.58,20.32 | J1.AT2 213.23,7.94 v213.23,20.32 | J1.AN2 225.93,7.94 v225.93,20.32 | J1.AF1 244.98,7.94 v244.98,20.32 | J1.BC1 185.29,7.94 v185.29,20.32 | J1.DN1 22.73,7.94 v22.73,20.32 | J1.DF2 41.78,7.94 v41.78,20.32 | J1.DC2 51.94,7.94 v51.94,20.32 | J1.CN2 92.58,7.94 v92.58,20.32 | J1.CF2 111.63,7.94 v111.63,20.32 | J1.CC2 121.79,7.94 v121.79,20.32 | J1.BT1 143.38,7.94 v143.38,20.32 | J1.BN1 156.08,7.94 v156.08,20.32 | J1.BF1 175.13,7.94 v175.13,20.32 | 233.55,30.48 238.63,30.48 C30.- | C6.2 223.39,58.42 233.55,58.42 E1.10 | J4.UU J4.VV J4.TT | J4.SS J4.TT | J4.TT 30.35,157.48 | 30.35,157.48 C18.2 C17.1 | U10.15 30.35,157.48 | J4.B J4.A
  Bottom 1.27: R7.1 C2.2 SW1.8 SW1.7 SW1.6 SW1.5 60.83,194.59 SW2.3 60.83,195.15 60.83,201.09 SW2.4 58.72,203.2 39.24,203.2 30.35,194.31 30.35,191.16 J5.5 | U1.22 98.93,172.72 U1.8 C7.2 C9.2 116.71,170.18 116.71,163.83 119.25,161.29 | C21.2 243.71,119.38 | C20.2 220.85,119.38 | E4.14 251.33,160.02 233.55,160.02 | 233.55,160.02 231.01,160.02 | 233.55,187.96 233.55,160.02 | C23.2 190.37,134.62 185.29,134.62 185.29,143.51 167.51,161.29 119.25,161.29 | R20.1 119.25,161.29 | E1.19 233.55,30.48 | 233.55,30.48 C29.2 | v162.43,33.02 159.89,35.56 E2.19
INITIALIZE
  Top 0.508: J1.CR1 86.23,8.26 86.23,38.1 U9.10 U9.9 88.77,48.26 Q1.1
MD_DIR
  Bottom 0.508: E7.9 189.1,153.67 192.91,153.67 | 192.91,153.67 199.26,153.67 E8.12 | E8.3 204.34,143.51 194.18,143.51 192.91,144.78 192.91,153.67
MEM00  (via drill 0.81)
  Top 0.508: v256.41,39.37 256.41,167.64 255.14,168.91 250.06,168.91 E4.15
  Bottom 0.508: E1.18 233.55,38.1 234.82,39.37 v256.41,39.37
MEM01  (via drill 0.81)
  Top 0.508: v258.95,40.64 258.95,149.86 v257.68,151.13
  Bottom 0.508: v257.68,151.13 E4.13 | E1.17 233.55,40.64 234.82,41.91 257.68,41.91 v258.95,40.64
MEM02  (via drill 0.81)
  Top 0.508: v255.14,45.72 255.14,104.14 253.87,105.41 253.87,114.3 255.14,115.57 255.14,151.13 E4.12
  Bottom 0.508: v255.14,45.72 253.87,44.45 234.82,44.45 233.55,43.18 E1.16
MEM03  (via drill 0.81)
  Top 0.508: v257.68,46.99 v257.68,146.05
  Bottom 0.508: v257.68,146.05 E4.11 | E1.15 229.74,46.99 v257.68,46.99
MEM04
  Top 0.508: E3.16 209.42,148.59 209.42,133.35 206.88,130.81 205.61,130.81 197.99,123.19 197.99,100.33 159.89,62.23 159.89,48.26 158.62,46.99 158.62,39.37 E2.18
MEM05  (via drill 0.81 pad 0.25)
  Top 0.508: E3.17 210.69,147.32 210.69,133.35 206.88,129.54 205.61,129.54 199.26,123.19 199.26,100.33 161.16,62.23 161.16,48.26 159.89,46.99 v159.89,40.64
  Bottom 0.508: E2.17 v159.89,40.64
MEM06  (via drill 0.81 pad 0.25)
  Top 0.508: E3.18 211.96,146.05 211.96,133.35 206.88,128.27 205.61,128.27 200.53,123.19 200.53,100.33 162.43,62.23 162.43,48.26 161.16,46.99 v161.16,43.18
  Bottom 0.508: E2.16 v161.16,43.18
MEM07  (via drill 0.81 pad 0.25)
  Top 0.508: E3.19 213.23,144.78 213.23,133.35 206.88,127 205.61,127 201.8,123.19 201.8,100.33 163.7,62.23 163.7,46.99 v162.43,45.72
  Bottom 0.508: E2.15 v162.43,45.72
MEM08
  Top 0.508: E3.15 214.5,158.75 189.1,158.75 186.56,156.21 186.56,135.89 191.64,130.81 191.64,95.25 158.62,62.23 158.62,49.53 E2.14
MEM09
  Top 0.508: E3.13 223.39,162.56 189.1,162.56 182.75,156.21 182.75,135.89 187.83,130.81 187.83,95.25 154.81,62.23 154.81,53.34 E2.13
MEM10
  Top 0.508: E3.12 222.12,161.29 189.1,161.29 184.02,156.21 184.02,135.89 189.1,130.81 189.1,95.25 156.08,62.23 156.08,54.61 E2.12
MEM11
  Top 0.508: E3.11 220.85,160.02 189.1,160.02 185.29,156.21 185.29,135.89 190.37,130.81 190.37,95.25 157.35,62.23 E2.11
N$1
  Bottom 0.508: Y1.1 109.09,185.29 R18.2 C7.1 U1.10
N$2
  Bottom 0.508: U1.9 111.63,175.26 C9.1 114.17,182.88 | R18.1 114.17,182.88 | Y1.2 114.17,185.29 114.17,182.88
N$3
  Bottom 0.508: S1.8 238.63,116.84 239.9,118.11 247.52,118.11 E5.7
N$4
  Bottom 0.508: Q1.3 R5.1
N$5
  Bottom 0.508: Q1.2 R10.2
N$6
  Bottom 0.508: R6.1 55.75,160.02 Q2.3
N$7
  Bottom 0.508: R11.2 Q2.2
N$8
  Bottom 0.508: U9.12 U9.3
N$9
  Top 0.508: U8.5 U8.4 U8.3
  Bottom 0.508: U8.12 U8.3
N$10  (via drill 0.81 pad 0.25)
  Top 0.508: U9.2 97.66,36.83 97.66,44.45 100.2,44.45 v104.01,48.26
  Bottom 0.508: U9.13 U9.2 | v104.01,48.26 U8.8
N$12  (via drill 0.81)
  Top 0.508: R17.1 25.27,157.48 v29.08,153.67
  Bottom 0.508: v29.08,153.67 31.62,151.13 95.12,151.13 U1.3
N$13  (via drill 0.81)
  Top 0.508: R16.1 22.73,157.48 v27.81,152.4
  Bottom 0.508: v27.81,152.4 30.35,149.86 96.39,149.86 U1.2
N$15
  Bottom 0.508: U9.8 92.58,46.99 117.98,46.99 U8.9
N$16
  Top 0.508: C17.2 34.16,166.37 41.78,166.37 U10.6
N$17
  Bottom 0.508: U10.1 C14.1
N$18
  Bottom 0.508: E5.9 241.17,116.84 238.63,114.3 S1.7
N$19
  Bottom 0.508: E5.10 241.17,114.3 238.63,111.76 S1.6
N$20
  Bottom 0.508: E5.11 241.17,111.76 238.63,109.22 S1.5
N$21
  Bottom 0.508: E5.12 241.17,109.22 238.63,106.68 S1.4
N$22
  Bottom 0.508: E5.13 241.17,106.68 238.63,104.14 S1.3
N$23
  Bottom 0.508: E5.14 241.17,101.6 S1.2
N$24
  Bottom 0.508: E5.15 241.17,99.06 S1.1
N$25
  Bottom 0.508: D2.A 253.87,182.25 B1.+@3 254.51,182.88 B1.+ 253.24,186.69 B1.+@4 253.24,189.23 B1.+@1 254.51,193.04 B1.+@2
N$26
  Bottom 0.508: S1.13 R23.4 222.12,105.41 211.96,105.41 E6.2
N$27
  Bottom 0.508: S1.14 R23.3 222.12,102.87 211.96,102.87 E6.1
N$28
  Bottom 0.508: S1.12 R23.5 222.12,107.95 211.96,107.95 E6.3
N$29
  Bottom 0.508: S1.11 R23.6 222.12,110.49 211.96,110.49 E6.4
N$30
  Bottom 0.508: S1.10 R23.7 222.12,113.03 211.96,113.03 E6.5
N$31
  Bottom 0.508: S1.9 R23.8 222.12,115.57 211.96,115.57 E6.6
N$32
  Bottom 0.508: S1.16 R23.1 220.85,96.52 210.69,96.52 208.15,99.06 208.15,101.6 E6.12
N$33
  Bottom 0.508: S1.15 R23.2 219.58,97.79 211.96,97.79 209.42,100.33 209.42,102.87 E6.11
N$36
  Bottom 0.508: Q3.2 R24.2
N$39
  Bottom 0.508: R25.2 E1.6
N$55
  Bottom 0.508: E1.9 R25.5
N$56
  Bottom 0.508: E1.8 R25.4
N$57
  Bottom 0.508: E1.7 R25.3
N$827
  Bottom 0.508: U10.3 C14.2
N$914
  Bottom 0.508: U10.5 45.59,167.64 C15.2
N$915
  Bottom 0.508: U10.4 C15.1
N$916
  Bottom 0.508: U10.2 48.13,157.48 C16.1
N$918
  Bottom 0.508: R12.2 55.75,177.8 55.75,194.59 SW2.1 55.75,195.15 55.75,201.09 SW2.2
N$919
  Bottom 0.508: SW1.1 R3.2
N$920
  Bottom 0.508: SW1.2 R4.2
N$921
  Bottom 0.508: SW1.3 R8.2
N$922
  Bottom 0.508: SW1.4 R9.2
POWER_OK  (via drill 0.81, 0.81 pad 0.25)
  Top 0.508: R24.1 185.29,93.98 159.89,68.58 v158.62,68.58 | v137.03,17.78 v137.03,68.58
  Bottom 0.508: J1.BV2 137.03,8.26 v137.03,17.78 | v158.62,68.58 v137.03,68.58
PROG  (via drill 0.81 pad 0.25)
  Top 0.508: U10.12 36.7,163.83 v36.7,148.59
  Bottom 0.508: U10.12 U10.11 31.62,171.45 27.81,171.45 25.27,173.99 25.27,181.61 J2.1 | v36.7,148.59 97.66,148.59 102.74,153.67 115.44,153.67 C11.2 111.63,160.02 R20.2
PULSE_LA  (via drill 0.81)
  Top 0.508: v16.38,17.78 v16.38,31.75 | v18.92,50.8 18.92,59.69 60.83,101.6 Q2.1
  Bottom 0.508: J1.DR2 16.38,8.26 v16.38,17.78 | v16.38,31.75 18.92,34.29 v18.92,50.8
R_RUN  (via drill 0.81 pad 0.25)
  Top 0.508: v130.68,175.26 R2.1
  Bottom 0.508: U1.14 116.71,187.96 121.79,182.88 v130.68,175.26
R_SW  (via drill 0.81 pad 0.25)
  Top 0.508: C10.1 51.94,100.33 51.94,161.29 R12.1 | U1.15 97.66,186.69 97.66,163.83 v95.12,163.83
  Bottom 0.508: R1.1 C10.1 | v95.12,163.83 51.94,163.83 R12.1
RXD
  Top 0.508: U10.9 25.27,172.72 R16.2
  Bottom 0.508: R16.2 20.19,172.72 20.19,179.07 J2.2
RXD232
  Top 0.508: U10.8 43.05,186.77 J5.2
  Bottom 0.508: J4.J 21.46,186.69 35.43,186.69 39.09,190.35 J5.2
SCL
  Bottom 0.508: U11.6 208.15,60.96 R22.1 U2.12 192.91,66.04 192.91,82.55 114.17,161.29 102.74,161.29 U1.28
SDA
  Bottom 0.508: U11.5 208.15,63.5 R21.1 U2.13 194.18,67.31 194.18,82.55 114.17,162.56 106.55,162.56 105.28,163.83 102.74,163.83 U1.27
SET_FF  (via drill 0.81 pad 0.25)
  Top 0.508: U1.4 105.28,161.29 v105.28,33.02
  Bottom 0.508: U9.1 v105.28,33.02
SHOW_DATA  (via drill 0.81 pad 0.25)
  Top 0.508: U1.5 106.55,162.56 v106.55,34.29
  Bottom 0.508: U8.1 125.6,34.29 v106.55,34.29
SOURCE  (via drill 0.81)
  Top 0.508: v231.01,17.78 231.01,43.18 229.74,44.45 227.2,44.45 224.66,46.99 224.66,143.51 v219.58,148.59
  Bottom 0.508: J1.AL2 232.28,8.26 232.28,15.24 231.01,16.51 v231.01,17.78 | v219.58,148.59 209.42,148.59 E8.6
SW
  Bottom 0.508: J1.DV2 3.68,7.94 3.68,46.99 R1.2
TP4  (via drill 0.81)
  Top 0.508: v105.28,17.78 104.01,19.05 104.01,35.56 U9.4 U9.5
  Bottom 0.508: J1.CJ2 105.28,8.26 v105.28,17.78
TXD
  Top 0.508: R17.2 26.54,171.45 34.16,171.45 U10.10
  Bottom 0.508: J2.3 21.46,177.8 21.46,173.99 R17.2
TXD232
  Top 0.508: U10.7 41.78,171.45 41.78,185.27 J5.3
  Bottom 0.508: J4.F 20.19,187.96 34.16,187.96 36.55,190.35 J5.3
V+  (via drill 0.81 pad 0.25)
  Top 0.813: E3.28 C20.1
  Top 1.27: v248.79,124.46 248.79,165.1 D3.C D2.C
  Bottom 0.813: C20.1 215.77,123.19 217.04,124.46 220.85,124.46 223.39,121.92 C21.1 E4.28
  Bottom 1.27: R15.2 C20.1 | E4.28 v248.79,124.46
VCC  (via drill 0.81)
  Top 1.27: R23.9 R23.10 R23.11 R23.12 R23.13 R23.14 R23.15 R23.16 215.77,92.71 | U11.8 213.23,58.42 | 213.23,58.42 C6.1 213.23,35.56 U3.14 v210.69,22.86 | C19.1 213.23,58.42 | v191.64,17.78 v191.64,22.86 | v128.14,17.78 v128.14,22.86 | 10.03,33.02 v10.03,22.86 | U6.14 C26.1 v53.21,22.86 | 144.65,33.02 v144.65,22.86 | E1.20 C29.1 v228.47,22.86 | U4.14 144.65,33.02 | 144.65,33.02 C4.1 | U5.14 10.03,33.02 | 10.03,33.02 C3.1 | E2.20 C25.1 v157.35,22.86 | R21.2 215.77,83.82 215.77,92.71 | R13.2 86.23,175.26 83.69,175.26 | 83.69,175.26 83.69,177.8 | 83.69,177.8 58.29,177.8 C2.1 R14.2 | J3.2 88.77,190.5 | 88.77,190.5 84.96,190.5 83.69,189.23 83.69,177.8 | 83.69,175.26 R5.2 | 116.71,170.18 D1.C R19.2 | 116.71,170.18 U1.7 | C16.2 48.13,157.48 48.13,167.64 R6.2 | U7.14 76.07,33.02 | 76.07,33.02 C5.1 | 76.07,33.02 v76.07,22.86 | C12.1 93.85,33.02 | 93.85,33.02 v93.85,22.86 | U9.14 93.85,33.02 | C13.1 121.79,33.02 | 121.79,33.02 v121.79,22.86 | U8.14 121.79,33.02 | 215.77,92.71 C28.1 | 88.77,190.5 111.63,190.5 116.71,185.42 116.71,170.18
  Bottom 1.27: 213.23,95.25 209.42,95.25 E6.14 190.37,114.3 190.37,127 199.26,135.89 | E7.14 E7.13 E7.12 168.78,163.83 R19.2 | E7.14 E7.1 199.26,135.89 | 213.23,95.25 239.9,95.25 E5.16 246.25,96.52 251.33,96.52 260.22,105.41 C27.1 262.76,115.57 262.76,166.37 D3.A | C1.1 R22.2 205.61,71.12 | R21.2 205.61,71.12 | 205.61,71.12 C19.1 | U11.8 205.61,53.34 U2.9 192.91,58.42 U2.18 | J1.BA2 191.64,7.94 v191.64,17.78 | 261.49,22.86 v228.47,22.86 v210.69,22.86 v191.64,22.86 v157.35,22.86 v144.65,22.86 v128.14,22.86 v121.79,22.86 v93.85,22.86 v76.07,22.86 v53.21,22.86 v10.03,22.86 | J1.AA2 261.49,7.94 261.49,22.86 | J1.CA2 128.14,7.94 v128.14,17.78 | 261.49,22.86 C30.+ 261.49,40.64 258.95,43.18 R25.1 | 199.26,135.89 E8.20 C24.1 | C18.1 U10.16 37.97,152.4 48.13,152.4 C16.2 | R6.2 R14.2 C2.1 | R13.2 U1.21 U1.20 C8.1 | U7.12 U7.13 U7.14 | E7.14 C23.1 | C28.1 213.23,95.25
W_DATA_00
  Bottom 0.508: U2.7 199.26,48.26 200.53,46.99 219.58,46.99 219.58,34.29 U3.1
W_DATA_01
  Bottom 0.508: U2.6 201.8,41.91 217.04,41.91 U3.4
W_DATA_02
  Bottom 0.508: U2.5 203.07,38.1 U3.12
W_DATA_03
  Bottom 0.508: U2.3 196.72,39.37 196.72,46.99 199.26,46.99 200.53,45.72 U3.9
W_DATA_04
  Bottom 0.508: U4.1 153.54,36.83 166.24,36.83 168.78,34.29 196.72,34.29 U2.2
W_DATA_05  (via drill 0.81 pad 0.25)
  Top 0.508: v152.27,33.02 152.27,38.1 U4.4
  Bottom 0.508: 196.72,31.75 161.16,31.75 158.62,34.29 153.54,34.29 v152.27,33.02
  Bottom 0.61: U2.1 196.72,31.75
W_DATA_06
  Bottom 0.508: U4.12 143.38,39.37 166.24,39.37 168.78,36.83 186.56,36.83 187.83,35.56 U2.27
W_DATA_07
  Bottom 0.508: U4.9 143.38,44.45 166.24,44.45 168.78,41.91 186.56,41.91 U2.26
W_DATA_08
  Bottom 0.508: U5.1 16.38,34.29 16.38,54.61 18.92,57.15 173.86,57.15 U2.25
W_DATA_09
  Bottom 0.508: U5.4 13.84,41.91 13.84,54.61 15.11,55.88 16.38,55.88 18.92,58.42 177.67,58.42 U2.23
W_DATA_10
  Bottom 0.508: U5.12 11.3,41.91 11.3,53.34 15.11,57.15 16.38,57.15 18.92,59.69 178.94,59.69 U2.22
W_DATA_11
  Bottom 0.508: U5.9 8.76,46.99 8.76,54.61 15.11,60.96 180.21,60.96 U2.21
W_INITIALIZE  (via drill 0.81 pad 0.25)
  Top 0.508: R13.1 v88.77,167.64
  Bottom 0.508: U1.23 v88.77,167.64 86.23,170.18 R10.1
W_PULSE_LA
  Top 0.508: R14.1 55.75,170.18 R11.1
  Bottom 0.508: R11.1 65.91,165.1 U1.24
W_STOP  (via drill 0.81)
  Top 0.508: v63.37,48.26 63.37,134.62
  Top 0.61: 63.37,134.62 88.77,160.02 U1.26
  Bottom 0.508: U7.10 U7.9 65.91,45.72 v63.37,48.26
WRITE  (via drill 0.81)
  Top 0.508: v220.85,17.78 220.85,119.38 219.58,120.65 v219.58,146.05
  Bottom 0.508: J1.AS2 217.04,8.26 217.04,15.24 219.58,17.78 v220.85,17.78 | v219.58,146.05 211.96,146.05 E8.4

## Text on the board
Top: Select | 10 | 4 | 2 | TTL DSR | 1 | TTL RXD | TTL TXD | GND
tPlace: 32K Omnibus Memory | M847 extended edition V1.1 | Roland Huisman | 30-10-2018
_tsilk: Lit.3V | B1 | CR2032H | 0.1uF | 0.1uF | 74LS74N | 74LS14N | 0.1uF | IC9 | IC8 | C1 | 74LS10N | 100K | 22uF | 0.1uF | 62256 | 62256 | 200pF | C2 | IC7 | 2N3904 | 100K | DIS | EN | 7 | IC3 | 6 | 10K | IC4 | 5 | 4 | 3 | 2 | R5 | 1 | 0.1uF | 0.1uF | 0 | S1 | ON | 0.1uF | 74ALS245AN | 74ALS245AN | 0.1uF | 74ACT138N | 74HCT30N | 10K | 10K | 10K | IC2 | IC1 | C10 | 100uF | 10K | IC6 | IC5 | DV1 | DU1 | DT1 | DS1 | DR1 | DP1 | DN1 | DM1 | DL1 | DK1 | DJ1 | DH1 | DF1 | DE1 | DD1 | DC1 | DB1 | DA1 | CV1 | CU1 | CT1 | CS1 | CR1 | CP1 | CN1 | CM1 | CL1 | CK1 | CJ1 | CH1 | CF1 | CE1 | CD1 | CC1 | CB1 | CA1 | BV1 | BU1 | BT1 | BS1 | BR1 | BP1 | BN1 | BM1 | BL1 | BK1 | BJ1 | BH1 | BF1 | BE1 | BD1 | BC1 | BB1 | BA1 | AV1 | AU1 | AT1 | AS1 | AR1 | AP1 | AN1 | AM1 | AL1 | AK1 | AJ1 | AH1 | AF1 | AE1 | AD1 | AC1 | AB1 | AA1
_bsilk: DV2 | DU2 | DT2 | DS2 | DR2 | DP2 | DN2 | DM2 | DL2 | DK2 | DJ2 | DH2 | DF2 | DE2 | DD2 | DC2 | DB2 | DA2 | CV2 | CU2 | CT2 | CS2 | CR2 | CP2 | CN2 | CM2 | CL2 | CK2 | CJ2 | CH2 | CF2 | CE2 | CD2 | CC2 | CB2 | CA2 | BV2 | BU2 | BT2 | BS2 | BR2 | BP2 | BN2 | BM2 | BL2 | BK2 | BJ2 | BH2 | BF2 | BE2 | BD2 | BC2 | BB2 | BA2 | AV2 | AU2 | AT2 | AS2 | AR2 | AP2 | AN2 | AM2 | AL2 | AK2 | AJ2 | AH2 | AF2 | AE2 | AD2 | AC2 | AB2 | AA2